# EasyEDA schematic SCH_ECG__2023-09-13.json
TITLE: ECG Circuit; REV: 1.0; Date: 2023-02-09; Sheet: 1/1; Drawn By: yasirueranda20; Company: ENTC
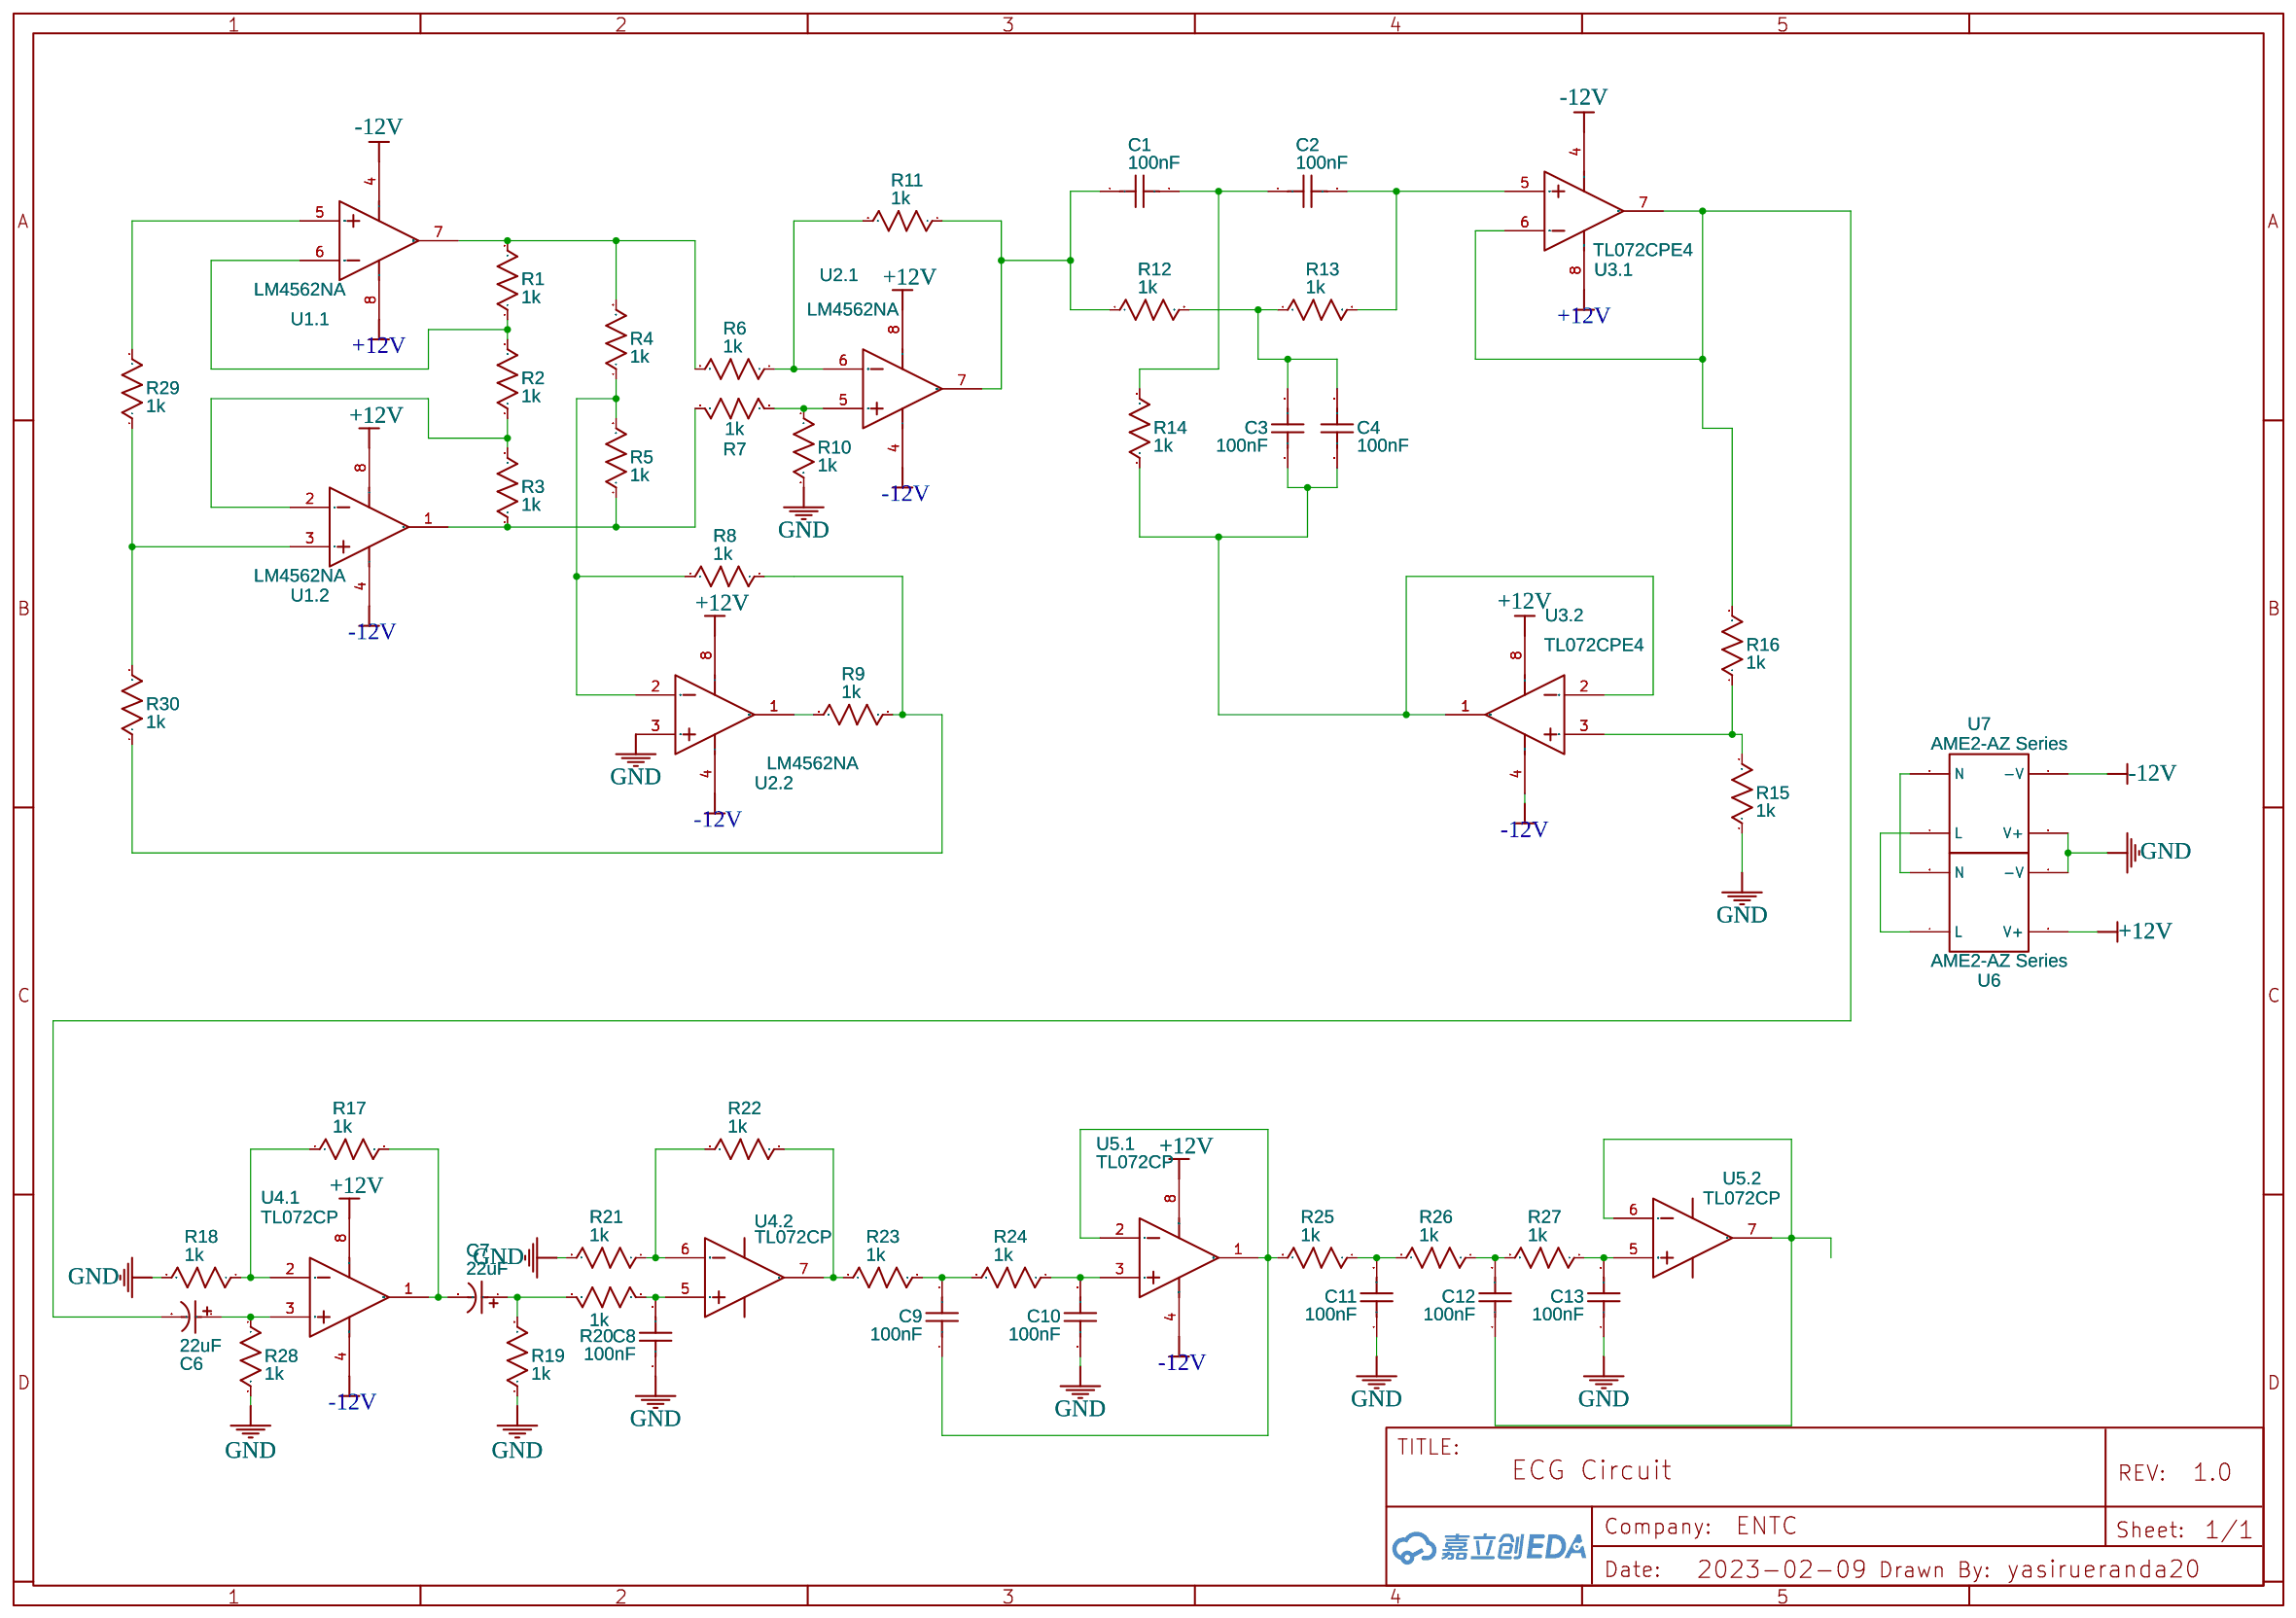
[diagram p0: schematic sheet]

## Parts
C1  100nF  [CAP-TH_L7.5-W4.5-P5.00-D0.5]
C2  100nF  [CAP-TH_L7.5-W4.5-P5.00-D0.5]
C3  100nF  [CAP-TH_L7.5-W4.5-P5.00-D0.5]
C4  100nF  [CAP-TH_L7.5-W4.5-P5.00-D0.5]
C6  22uF  [CAP-TH_BD13.0-P5.00-D0.6-FD]
C7  22uF  [CAP-TH_BD13.0-P5.00-D0.6-FD]
C8  100nF  [CAP-TH_L7.5-W4.5-P5.00-D0.5]
C9  100nF  [CAP-TH_L7.5-W4.5-P5.00-D0.5]
C10  100nF  [CAP-TH_L7.5-W4.5-P5.00-D0.5]
C11  100nF  [CAP-TH_L7.5-W4.5-P5.00-D0.5]
C12  100nF  [CAP-TH_L7.5-W4.5-P5.00-D0.5]
C13  100nF  [CAP-TH_L7.5-W4.5-P5.00-D0.5]
R1  1k  [R_AXIAL-0.4]
R2  1k  [R_AXIAL-0.4]
R3  1k  [R_AXIAL-0.4]
R4  1k  [R_AXIAL-0.4]
R5  1k  [R_AXIAL-0.4]
R6  1k  [R_AXIAL-0.4]
R7  1k  [R_AXIAL-0.4]
R8  1k  [R_AXIAL-0.4]
R9  1k  [R_AXIAL-0.4]
R10  1k  [R_AXIAL-0.4]
R11  1k  [R_AXIAL-0.4]
R12  1k  [R_AXIAL-0.4]
R13  1k  [R_AXIAL-0.4]
R14  1k  [R_AXIAL-0.4]
R15  1k  [R_AXIAL-0.4]
R16  1k  [R_AXIAL-0.4]
R17  1k  [R_AXIAL-0.4]
R18  1k  [R_AXIAL-0.4]
R19  1k  [R_AXIAL-0.4]
R20  1k  [R_AXIAL-0.4]
R21  1k  [R_AXIAL-0.4]
R22  1k  [R_AXIAL-0.4]
R23  1k  [R_AXIAL-0.4]
R24  1k  [R_AXIAL-0.4]
R25  1k  [R_AXIAL-0.4]
R26  1k  [R_AXIAL-0.4]
R27  1k  [R_AXIAL-0.4]
R28  1k  [R_AXIAL-0.4]
R29  1k  [PROBE]
R30  1k  [PROBE]
U1  LM4562NA  [DIP8]  (sections 1,2)
U2  LM4562NA  [DIP8]  (sections 1,2)
U3  TL072CPE4  [DIP8]  (sections 1,2)
U4  TL072CP  [DIP-8_L9.6-W6.4-P2.54-LS7.6-BL-1]  (sections 1,2)
U5  TL072CP  [DIP-8_L9.6-W6.4-P2.54-LS7.6-BL-1]  (sections 1,2)
U6  AME2-AZ Series  [230V AC TO 12V DC SMPS]
U7  AME2-AZ Series  [230V AC TO 12V DC SMPS]

## Library data of the parts
C1-C4 C8-C13 = LX2A104JD5B0070060035EOX: Supplier: LCSC; Supplier Part: C435350; Manufacturer: STE(松田); Contributor: LCSC; JLCPCB Part Class: Extended Part
C6 C7 = 22uF 50V 5*11: Supplier: LCSC; Manufacturer: CX(承兴); Manufacturer Part: KM226M050D11RR0VH2FP0; Supplier Part: C43346; JLCPCB Part Class: Extended Part
R1 = R_AXIAL-0.4_US: Contributor: LCEDA_Lib
R2-R30 = R_0603_US: Contributor: LCEDA_Lib
U1 U2 = LM4562NA: Dual High Performance, High Fidelity Audio Operational Amplifier, 8-pin MDIP; subpart_no: 1
U3 = TL072CPE4: Dual Low-Noise JFET-Input General-Purpose Operational Amplifier, 7 to 36 V, 0 to 70 degC, 8-pin DIP (P8), Pb-Free (RoHS); subpart_no: 1
U4 U5 = TL072CP: tags: FET Operational Amplifier; Supplier Part: C7236; Supplier: LCSC; Manufacturer: TI(德州仪器); subpart_no: 1; JLCPCB Part Class: Extended Part
U6 U7 = AME2-AZ Series: Manufacturer: Aimtec; Contributor: alexuskraft

## Nets
+12V: U1.8(V+) U2.8(V+) U3.8(VCC+) U4.8(VCC+) U5.8(VCC+) U6.2(V+)
-12V: U1.4(V-) U2.4(V-) U3.4(VCC-) U4.4(VCC-) U5.4(VCC-) U7.1(-V)
GND: C8.1 C10.1 C11.1 C13.1 R10.2 R15.1 R18.2 R19.1 R21.2 R28.2 U2.3(IN A) U6.1(-V) U7.2(V+)
Net-(C1-1): C1.1 R11.1 R12.1 U2.7(OUT B)
Net-(C1-2): C1.2 C2.1 R14.2
Net-(C2-2): C2.2 R13.2 U3.5(IN2+)
Net-(C3-1): C3.1 C4.1 R14.1 U3.1(OUT1) U3.2(IN1-)
Net-(C3-2): C3.2 C4.2 R12.2 R13.1
Net-(C6-1): C6.1 R28.1 U4.3(IN1+)
Net-(C6-2): C6.2 R16.2 U3.6(IN2-) U3.7(OUT2)
Net-(C7-1): C7.1 R19.2 R20.2
Net-(C7-2): C7.2 R17.2 U4.1(OUT1)
Net-(C8-2): C8.2 R20.1 U4.5(IN2+)
Net-(C9-1): C9.1 R25.2 U5.1(OUT1) U5.2(IN1-)
Net-(C9-2): C9.2 R23.2 R24.2
Net-(C10-2): C10.2 R24.1 U5.3(IN1+)
Net-(C11-2): C11.2 R25.1 R26.2
Net-(C12-1): C12.1 U5.6(IN2-) U5.7(OUT2)
Net-(C12-2): C12.2 R26.1 R27.2
Net-(C13-2): C13.2 R27.1 U5.5(IN2+)
Net-(R1-1): R1.1 R2.2 U1.6(IN B)
Net-(R1-2): R1.2 R4.2 R6.2 U1.7(OUT B)
Net-(R2-1): R2.1 R3.2 U1.2(IN A)
Net-(R3-1): R3.1 R5.1 R7.2 U1.1(OUT A)
Net-(R4-1): R4.1 R5.2 R8.2 U2.2(IN A)
Net-(R6-1): R6.1 R11.2 U2.6(IN B)
Net-(R7-1): R7.1 R10.1 U2.5(IN B)
Net-(R8-1): R8.1 R9.1 R30.1
Net-(R9-2): R9.2 U2.1(OUT A)
Net-(R15-2): R15.2 R16.1 U3.3(IN1+)
Net-(R17-1): R17.1 R18.1 U4.2(IN1-)
Net-(R21-1): R21.1 R22.2 U4.6(IN2-)
Net-(R22-1): R22.1 R23.1 U4.7(OUT2)
Net-(R29-1): R29.1 R30.2 U1.3(IN A)
Net-(R29-2): R29.2 U1.5(IN B)
Net-(U6-3): U6.3(N) U7.3(N)
Net-(U6-4): U6.4(L) U7.4(L)
